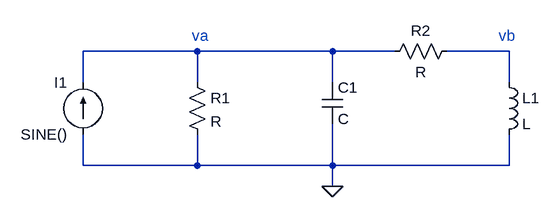
[diagram p0: schematic Q4 blank.asc]
Q4 blank.asc, the LTspice schematic file:
Version 4.1
SHEET 1 880 680
WIRE 160 64 -16 64
WIRE 368 64 160 64
WIRE 464 64 368 64
WIRE 640 64 544 64
WIRE -16 112 -16 64
WIRE 160 112 160 64
WIRE 368 112 368 64
WIRE 640 112 640 64
WIRE -16 240 -16 192
WIRE 160 240 160 192
WIRE 160 240 -16 240
WIRE 368 240 368 176
WIRE 368 240 160 240
WIRE 640 240 640 192
WIRE 640 240 368 240
WIRE 368 272 368 240
FLAG 368 272 0
SYMBOL current -16 192 R180
WINDOW 0 24 80 Left 2
WINDOW 3 24 0 Left 2
WINDOW 123 0 0 Left 0
WINDOW 39 0 0 Left 0
SYMATTR InstName I1
SYMATTR Value SINE()
SYMBOL res 144 96 R0
SYMATTR InstName R1
SYMBOL res 560 48 R90
WINDOW 0 0 56 VBottom 2
WINDOW 3 32 56 VTop 2
SYMATTR InstName R2
SYMBOL cap 352 112 R0
SYMATTR InstName C1
SYMBOL ind 624 96 R0
SYMATTR InstName L1
TEXT 152 40 Left 2 ;va
TEXT 624 40 Left 2 ;vb

The netlist it stands for:
* Q4 blank.asc
I1 0 N001 SINE()
R1 N001 0 R
R2 N002 N001 R
C1 N001 0 C
L1 N002 0 L
* va
* vb
.backanno
.end